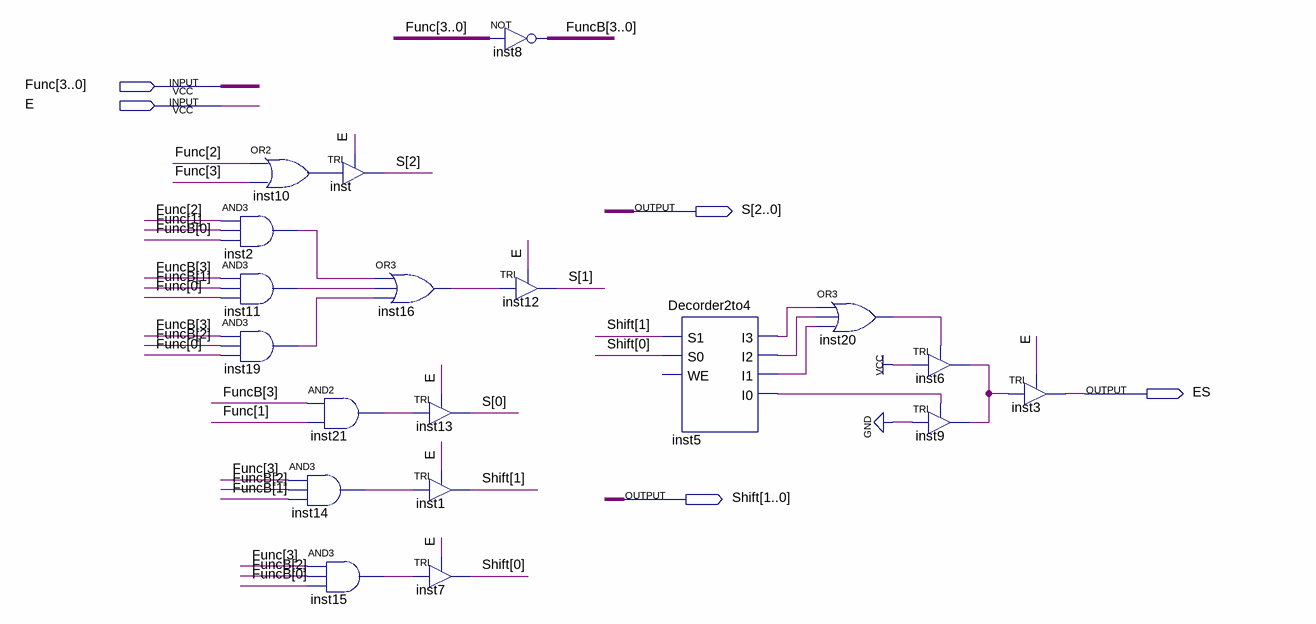
[diagram p0: schematic sheet]
// Quartus schematic RRR_Instruction_Design.bdf as structural Verilog: 19 symbols, 5 pins
module RRR_Instruction_Design (
  input  [3:0] Func,
  input  E,
  output [2:0] S,
  output ES,
  output [1:0] Shift
);

  wire inst2_out, inst5_i0, inst5_i1, inst5_i2, inst5_i3, inst6_out, inst10_out, inst11_out, inst14_out,
       inst15_out, inst16_out, inst19_out, inst20_out, inst21_out;
  wire [3:0] FuncB;

  or inst10 (inst10_out, Func[2], Func[3]);
  and inst2 (inst2_out, Func[2], Func[1], FuncB[0]);
  and inst11 (inst11_out, FuncB[3], FuncB[1], Func[0]);
  and inst19 (inst19_out, FuncB[3], FuncB[2], Func[0]);
  TRI inst (.IN(inst10_out), .OE(E), .OUT(S[2]));
  and inst21 (inst21_out, FuncB[3], Func[1]);
  and inst14 (inst14_out, Func[3], FuncB[2], FuncB[1]);
  and inst15 (inst15_out, Func[3], FuncB[2], FuncB[0]);
  or inst16 (inst16_out, inst2_out, inst11_out, inst19_out);
  TRI inst13 (.IN(inst21_out), .OE(E), .OUT(S[0]));
  TRI inst1 (.IN(inst14_out), .OE(E), .OUT(Shift[1]));
  TRI inst7 (.IN(inst15_out), .OE(E), .OUT(Shift[0]));
  assign FuncB = ~Func;  // NOT inst8, 4 bits wide
  TRI inst12 (.IN(inst16_out), .OE(E), .OUT(S[1]));
  Decorder2to4 inst5 (
    .S1(Shift[1]), .S0(Shift[0]), .I3(inst5_i3), .I2(inst5_i2), .I1(inst5_i1), .I0(inst5_i0));  // open: WE
  or inst20 (inst20_out, inst5_i3, inst5_i2, inst5_i1);
  TRI inst6 (.IN(1'b1), .OE(inst20_out), .OUT(inst6_out));
  TRI inst9 (.IN(1'b0), .OE(inst5_i0), .OUT(inst6_out));
  TRI inst3 (.IN(inst6_out), .OE(E), .OUT(ES));
endmodule
